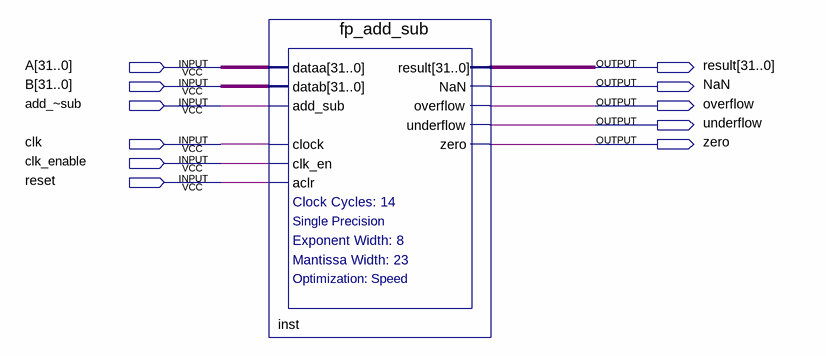
[diagram p0: schematic sheet]
// Quartus schematic fp_add_sub.bdf as structural Verilog: 1 symbols, 11 pins
module fp_add_sub (
  input  [31:0] A,
  input  [31:0] B,
  input  \add_~sub ,
  input  clk,
  input  clk_enable,
  input  reset,
  output [31:0] result,
  output NaN,
  output overflow,
  output underflow,
  output zero
);

  fp_add_sub inst (
    .dataa(A), .datab(B), .add_sub(\add_~sub ), .clock(clk), .clk_en(clk_enable), .aclr(reset),
    .result(result), .NaN(NaN), .overflow(overflow), .underflow(underflow), .zero(zero));
endmodule
